# Altium project Quadcopter Fligth Controller Board.PrjPcb (part 1 of 7)
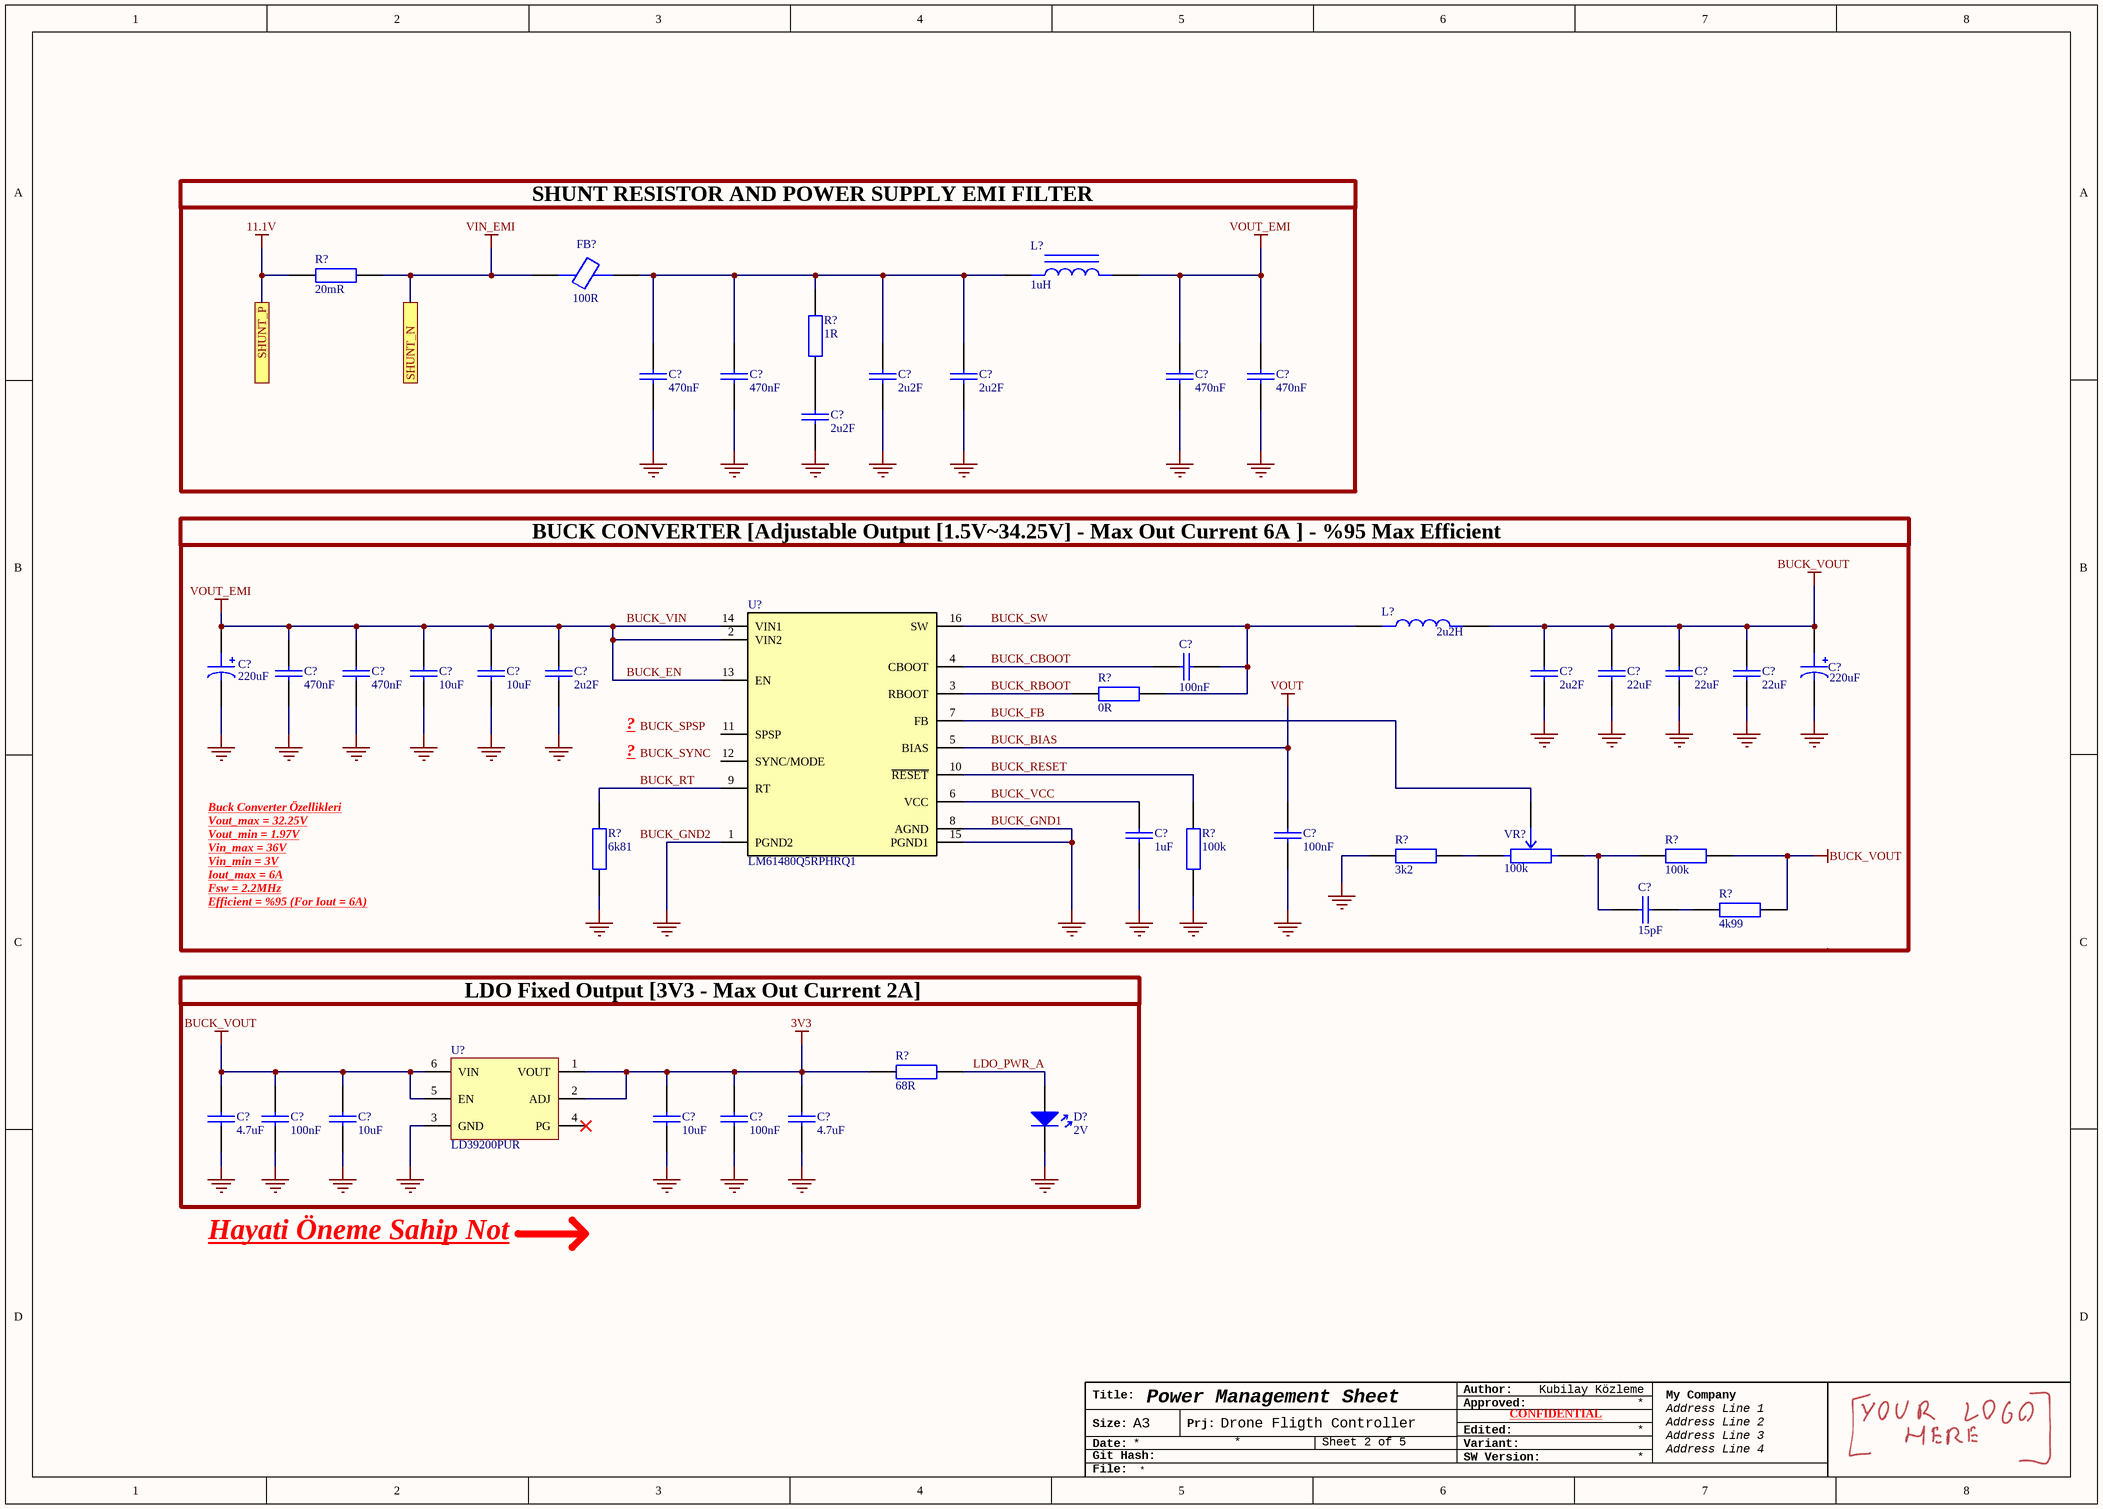
[diagram p0: Power.SchDoc]
4 sheets, 206 parts. Net scope: flat (ports and power ports of the same name join across sheets).
Board file: PCB.PcbDoc
Sheets:
  Power.SchDoc
  Microcontroller.SchDoc
  Peripherals.SchDoc
  Connector.SchDoc

## Sheet Power.SchDoc: Power Management Sheet
size A3; Author: Kubilay Közleme; Organization: My Company; Address1: Address Line 1; Address2: Address Line 2; Address3: Address Line 3; Address4: Address Line 4; SheetNumber: 2; SheetTotal: 5; ProjectTitle: Drone Fligth Controller

### Parts
(Parts that share a designator on the sheet are numbered #1, #2 ... from top to bottom, then left to right.)
C?#1  Capacitance: 470nF  [CAP_0603]  (hidden comment: CGA3E3X7R1H474K080AB)
C?#2  Capacitance: 470nF  [CAP_0603]  (hidden comment: CGA3E3X7R1H474K080AB)
C?#3  Capacitor Value: 2u2F  [CAP_0805]  (hidden comment: C0805C225K5RACAUTO)
C?#4  Capacitor Value: 2u2F  [CAP_0805]  (hidden comment: C0805C225K5RACAUTO)
C?#5  Capacitance: 470nF  [CAP_0603]  (hidden comment: CGA3E3X7R1H474K080AB)
C?#6  Capacitance: 470nF  [CAP_0603]  (hidden comment: CGA3E3X7R1H474K080AB)
C?#7  Capacitor Value: 2u2F  [CAP_0805]  (hidden comment: C0805C225K5RACAUTO)
C?#8  Capacitance Value: 220uF  [EEE-FT1H221AL]  (hidden comment: EEE-FT1H221AL)
C?#9  Capacitance Value: 220uF  [EEE-FT1H221AL]  (hidden comment: EEE-FT1H221AL)
C?#10  Capacitance: 100nF  [CAP_0805]  (hidden comment: CL21B104KBCNNNC)
C?#11  Capacitance: 470nF  [CAP_0603]  (hidden comment: CGA3E3X7R1H474K080AB)
C?#12  Capacitance: 470nF  [CAP_0603]  (hidden comment: CGA3E3X7R1H474K080AB)
C?#13  Capacitance: 10uF  [CAP_1206]  (hidden comment: CL31B106KBHNNNE)
C?#14  Capacitance: 10uF  [CAP_1206]  (hidden comment: CL31B106KBHNNNE)
C?#15  Capacitor Value: 2u2F  [CAP_0805]  (hidden comment: C0805C225K5RACAUTO)
C?#16  Capacitor Value: 2u2F  [CAP_0805]  (hidden comment: C0805C225K5RACAUTO)
C?#17  Capacitance Value: 22uF  [CAP_0805]  (hidden comment: C2012X5R1V226M125DC)
C?#18  Capacitance Value: 22uF  [CAP_0805]  (hidden comment: C2012X5R1V226M125DC)
C?#19  Capacitance Value: 22uF  [CAP_0805]  (hidden comment: C2012X5R1V226M125DC)
C?#20  Capacitance: 1uF  [CAP_0805]  (hidden comment: CL21B105KBFNNNE)
C?#21  Capacitance: 100nF  [CAP_0805]  (hidden comment: CL21B104KBCNNNC)
C?#22  Capacitance: 15pF  [CAP_0603]  (hidden comment: CC0603FRNPO9BN150)
C?#23  Capacitance: 4.7uF  [CAP_0805]  (hidden comment: CL21A475KAQNNNE)
C?#24  Capacitance: 100nF  [CAP_0603]  (hidden comment: C0603C104K1RACTU)
C?#25  value 10uF  [CAP_0603]  (hidden comment: ZRB18AR61C106ME01L)
C?#26  value 10uF  [CAP_0603]  (hidden comment: ZRB18AR61C106ME01L)
C?#27  Capacitance: 100nF  [CAP_0603]  (hidden comment: C0603C104K1RACTU)
C?#28  Capacitance: 4.7uF  [CAP_0805]  (hidden comment: CL21A475KAQNNNE)
D?#1  Forward Voltage: 2V  [LED GREEN CLEAR 0603 SMD]  (hidden comment: 150060RS75000)
FB?#1  Output Impedance: 100R  [74279226101]  (hidden comment: 74279226101)
L?#1  Inductance Value: 1uH  [74437336010]  (hidden comment: 74437336010)
L?#2  Inductor Value: 2u2H  [ETQ-P4M2R2KVC]  (hidden comment: ETQ-P4M2R2KVC)
R?#1  value 20mR  [VMP-R020-1.0-U]  (hidden comment: VMP-R020-1.0-U)
R?#2  Resistance: 1R  [RES_0603]  (hidden comment: CRCW06031R00FNEA)
R?#3  Resistance: 0R  [RES_0603]  (hidden comment: RC0603JR-070RL)
R?#4  Resistance: 3k2  [RES_0603]  (hidden comment: RT0603BRD073K2L)
R?#5  Resistance: 100k  [RES_0603]  (hidden comment: CRCW0603100KFKEA)
R?#6  Resistance: 6k81  [RES_0603]  (hidden comment: RT0603BRD076K81L)
R?#7  Resistance: 100k  [RES_0603]  (hidden comment: CRCW0603100KFKEA)
R?#8  Resistance: 4k99  [RES_0603]  (hidden comment: RC0603FR-074K99L)
R?#9  Resistance: 68R  [RES_0603]  (hidden comment: RC0603FR-0768RL)
U?#1  LM61480Q5RPHRQ1  [VQFN16]
U?#2  LD39200PUR  [LD39200PUR]
VR?  Resistance: 100k  [3313J-1-104E]  (hidden comment: 3313J-1-104E)

### Blocks framed on the sheet
SHUNT RESISTOR AND POWER SUPPLY EMI FILTER: C?#1-C?#7 FB?#1 L?#1 R?#1 R?#2
LDO Fixed Output [3V3 - Max Out Current 2A]: C?#23-C?#28 D?#1 R?#9 U?#2

### Ports
SHUNT_N (see Peripherals[5B]), SHUNT_P (see Peripherals[5B])

### Nets
3V3: C?#26.2 C?#27.2 C?#28.2 R?#9.1 U?#2.1(VOUT) U?#2.2(ADJ)
11.1V: R?#1.1 ; port SHUNT_P
BUCK_BIAS: C?#21.2 U?#1.5(BIAS)  [also labelled VOUT]
BUCK_EN: C?#5.2 C?#6.2 C?#8.1 C?#11.2 C?#12.2 C?#13.2 C?#14.2 C?#15.2 L?#1.2 U?#1.2(VIN2) U?#1.13(EN) U?#1.14(VIN1)  [also labelled BUCK_VIN, VOUT_EMI]
BUCK_GND1: C?#1.1 C?#2.1 C?#3.1 C?#4.1 C?#5.1 C?#6.1 C?#7.1 C?#8.2 C?#9.2 C?#11.1 C?#12.1 C?#13.1 C?#14.1 C?#15.1 C?#16.1 C?#17.1 C?#18.1 C?#19.1 C?#20.2 C?#21.1 C?#23.1 C?#24.1 C?#25.1 C?#26.1 C?#27.1 C?#28.1 D?#1.1(K) R?#4.1 R?#6.1 R?#7.1 U?#1.1(PGND2) U?#1.8(AGND) U?#1.15(PGND1) U?#2.3(GND)  [also labelled GND]
BUCK_VOUT: C?#9.1 C?#16.2 C?#17.2 C?#18.2 C?#19.2 C?#23.2 C?#24.2 C?#25.2 L?#2.2 R?#5.2 R?#8.2 U?#2.5(EN) U?#2.6(VIN)
VIN_EMI: FB?#1.1 R?#1.2 ; port SHUNT_N
BUCK_CBOOT: C?#10.2 U?#1.4(CBOOT)
BUCK_FB: U?#1.7(FB) VR?.WIPER
BUCK_RBOOT: R?#3.1 U?#1.3(RBOOT)
BUCK_RESET: R?#7.2 U?#1.10(~{RESET})
BUCK_RT: R?#6.2 U?#1.9(RT)
BUCK_SW: C?#10.1 L?#2.1 R?#3.2 U?#1.16(SW)
BUCK_VCC: C?#20.1 U?#1.6(VCC)
LDO_PWR_A: D?#1.2(A) R?#9.2
NetC?#1_2: C?#1.2 C?#2.2 C?#3.2 C?#4.2 FB?#1.2 L?#1.1 R?#2.2
NetC?#7_2: C?#7.2 R?#2.1
NetC?#22_1: C?#22.1 R?#8.1
NetC?#22_2: C?#22.2 R?#5.1 VR?.CW
NetR?#4_2: R?#4.2 VR?.CCW

Not connected (* = marked no-connect by the designer): U?#1 11(SPSP) 12(SYNC/MODE); U?#2 4(PG)*

### Notes on the sheet
- (near R?#1) Buck'a uygun LDO seçilecek (Max 2A)
  Güç çıkışlarına test pointler ve güç ledi konulacak
  VDD hattından max 320mA akım çekileceği için VDD girişine 320mA sigorta koyulacak
  Güç hattına kill switch koyulacak
- BUCK CONVERTER [Adjustable Output [1.5V~34.25V] - Max Out Current 6A ] - %95 Max Efficient
- (near C?#11) Kapasitörlerin rated voltage değerleri en az Vin*2 olacak şekilde tekrar seçilecek
- ?
- Vout_max = 32.25V
- Vout_min = 1.97V
- Vin_max = 36V
- Buck Converter Özellikleri
- Iout_max = 6A
- Fsw = 2.2MHz
- Efficient = %95 (For Iout = 6A)
- Vin_min = 3V
- (near R?#5) RFBT direnci : sabit 100k ohmluk direnç
  RFBB direnci : 100k ohmluk pot + 3k2 ohmluk sabit direnç
  *** RFBB direncinin değeri min 3k2 ohm olduğu için potun direnci 0 ohm iken çıkış geriliminin max değer olan 34.2V un üzerinde olmasını engellemek için oraya koyuldu
  *** Transient cevabın gerilim peeki için Feedforward kapasitörü koyulacak -> (Soft Transient) -> optional
- (near R?#6) RT pini pull down direnci : Buck Converterın anahtarlama frekansını ayarlama direncidir.
  ** Formül : RT (kΩ) = (16.4 / fSW (MHz)) - 0.633
- Hayati Öneme Sahip Not
- Buck ın çıkışı aynı zamanda ldoyuda besleyeceği için ldounun girişine 5V zener diyot koyulacak yoksa ldo yanar
- Labels drawn without touching a wire or pin: BUCK_GND2, BUCK_SPSP, BUCK_SYNC
- Title:
- Author:
- Approved:
- Size:
- Date:
- Git Hash:
- A3
- Prj:
- SW Version:
- Variant:
- Edited:
- CONFIDENTIAL
- File: